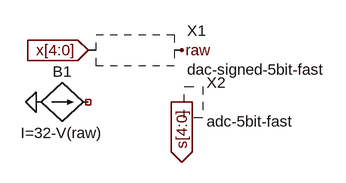
[diagram p0: schematic negate-5bit-fast.asc]
negate-5bit-fast.asc, the LTspice schematic file:
Version 4
SHEET 1 880 680
FLAG -304 128 x[4:0]
IOPIN -304 128 In
FLAG -160 208 s[4:0]
IOPIN -160 208 Out
FLAG -160 128 raw
FLAG -384 208 0
SYMBOL dac-signed-5bit-fast -240 128 R0
SYMATTR InstName X1
SYMBOL bi -384 208 R270
WINDOW 0 32 40 VTop 2
WINDOW 3 -32 40 VBottom 2
SYMATTR InstName B1
SYMATTR Value I=32-V(raw)
SYMATTR Value2 Rpar=1
SYMBOL adc-5bit-fast -224 208 R0
SYMATTR InstName X2

The netlist it stands for:
* negate-5bit-fast.asc
* X1: dac-signed-5bit-fast (symbol dac-signed-5bit-fast not available, pin order unknown); nets seen at it: raw, x[4:0]
B1 0 NC_01 I=32-V(raw) Rpar=1
* X2: adc-5bit-fast (symbol adc-5bit-fast not available, pin order unknown); nets seen at it: s[4:0]
.backanno
.end